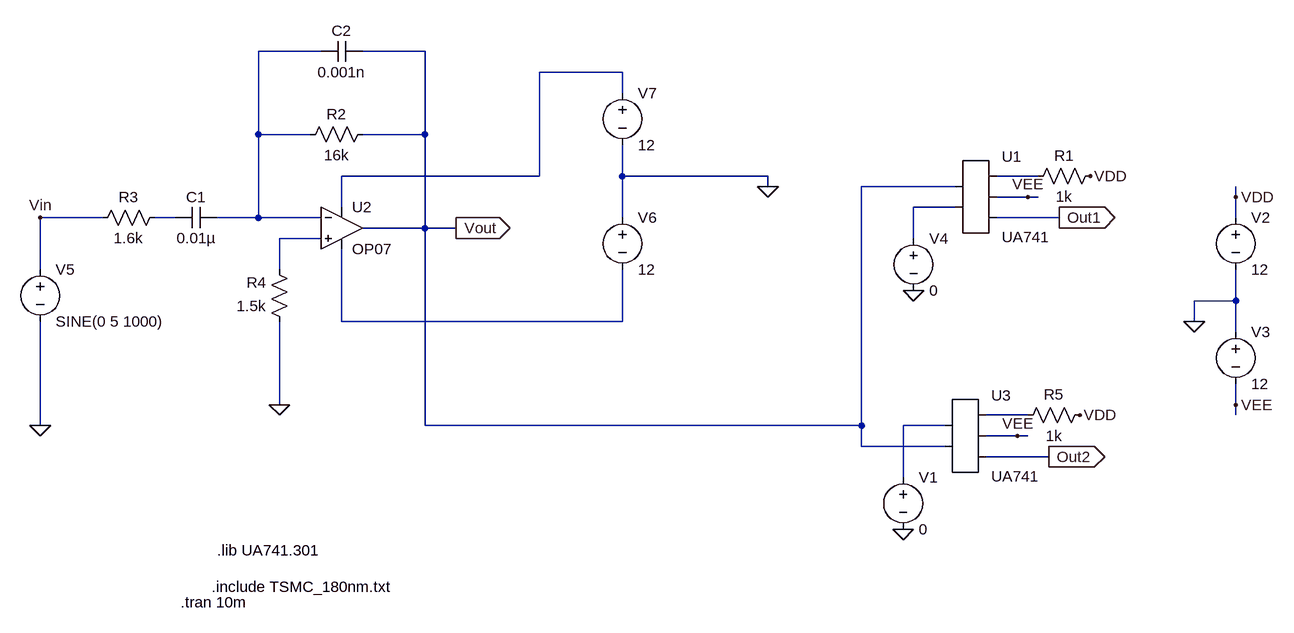
[diagram p0: schematic Lt_Spice simulation.asc]
Lt_Spice simulation.asc, the LTspice schematic file:
Version 4
SHEET 1 1080 680
WIRE -384 -256 -480 -256
WIRE -224 -256 -320 -256
WIRE 80 -224 -48 -224
WIRE 80 -192 80 -224
WIRE -480 -128 -480 -256
WIRE -400 -128 -480 -128
WIRE -224 -128 -224 -256
WIRE -224 -128 -320 -128
WIRE -48 -64 -48 -224
WIRE -48 -64 -352 -64
WIRE 80 -64 80 -112
WIRE 304 -64 80 -64
WIRE 720 -64 656 -64
WIRE 304 -48 304 -64
WIRE 592 -48 448 -48
WIRE 704 -32 656 -32
WIRE 720 -32 704 -32
WIRE 1024 -32 1024 -48
WIRE -352 -16 -352 -64
WIRE 592 -16 528 -16
WIRE -720 0 -816 0
WIRE -608 0 -640 0
WIRE -480 0 -480 -128
WIRE -480 0 -544 0
WIRE -384 0 -480 0
WIRE 80 0 80 -64
WIRE 752 0 656 0
WIRE 1024 0 1024 -32
WIRE -224 16 -224 -128
WIRE -224 16 -320 16
WIRE -176 16 -224 16
WIRE -384 32 -448 32
WIRE 528 32 528 -16
WIRE -816 80 -816 0
WIRE -448 80 -448 32
WIRE 1024 128 1024 80
WIRE 1024 128 960 128
WIRE -352 160 -352 48
WIRE 80 160 80 80
WIRE 80 160 -352 160
WIRE 960 160 960 128
WIRE 1024 176 1024 128
WIRE -448 288 -448 160
WIRE 1024 288 1024 256
WIRE 704 304 640 304
WIRE 1024 304 1024 288
WIRE -816 320 -816 160
WIRE -224 320 -224 16
WIRE 448 320 448 -48
WIRE 448 320 -224 320
WIRE 576 320 512 320
WIRE 688 336 640 336
WIRE 704 336 688 336
WIRE 448 352 448 320
WIRE 576 352 448 352
WIRE 736 368 640 368
WIRE 512 400 512 320
FLAG 960 160 0
FLAG 752 0 Out1
IOPIN 752 0 Out
FLAG 704 -32 VEE
FLAG 1024 288 VEE
FLAG 528 112 0
FLAG 800 -64 VDD
FLAG 1024 -32 VDD
FLAG -816 320 0
FLAG -448 288 0
FLAG 304 -48 0
FLAG -816 0 Vin
FLAG -176 16 Vout
IOPIN -176 16 Out
FLAG 736 368 Out2
IOPIN 736 368 Out
FLAG 688 336 VEE
FLAG 512 480 0
FLAG 784 304 VDD
SYMBOL AutoGenerated\\UA741 624 -32 R0
SYMATTR InstName U1
SYMBOL voltage 1024 -16 R0
WINDOW 123 0 0 Left 0
WINDOW 39 0 0 Left 0
SYMATTR InstName V2
SYMATTR Value 12
SYMBOL voltage 1024 160 R0
WINDOW 123 0 0 Left 0
WINDOW 39 0 0 Left 0
SYMATTR InstName V3
SYMATTR Value 12
SYMBOL voltage 528 16 R0
WINDOW 123 0 0 Left 0
WINDOW 39 0 0 Left 0
SYMATTR InstName V4
SYMATTR Value 0
SYMBOL res 816 -80 R90
WINDOW 0 0 56 VBottom 2
WINDOW 3 32 56 VTop 2
SYMATTR InstName R1
SYMATTR Value 1k
SYMBOL res -304 -144 R90
WINDOW 0 0 56 VBottom 2
WINDOW 3 32 56 VTop 2
SYMATTR InstName R2
SYMATTR Value 16k
SYMBOL OpAmps\\OP07 -352 -48 R0
SYMATTR InstName U2
SYMBOL res -624 -16 R90
WINDOW 0 0 56 VBottom 2
WINDOW 3 32 56 VTop 2
SYMATTR InstName R3
SYMATTR Value 1.6k
SYMBOL res -432 176 R180
WINDOW 0 36 76 Left 2
WINDOW 3 36 40 Left 2
SYMATTR InstName R4
SYMATTR Value 1.5k
SYMBOL cap -544 -16 R90
WINDOW 0 0 32 VBottom 2
WINDOW 3 32 32 VTop 2
SYMATTR InstName C1
SYMATTR Value 0.01µ
SYMBOL voltage -816 64 R0
WINDOW 123 0 0 Left 0
WINDOW 39 0 0 Left 0
SYMATTR InstName V5
SYMATTR Value SINE(0 5 1000)
SYMBOL voltage 80 -16 R0
WINDOW 123 0 0 Left 0
WINDOW 39 0 0 Left 0
SYMATTR InstName V6
SYMATTR Value 12
SYMBOL voltage 80 -208 R0
WINDOW 123 0 0 Left 0
WINDOW 39 0 0 Left 0
SYMATTR InstName V7
SYMATTR Value 12
SYMBOL cap -320 -272 R90
WINDOW 0 0 32 VBottom 2
WINDOW 3 32 32 VTop 2
SYMATTR InstName C2
SYMATTR Value 0.001n
SYMBOL AutoGenerated\\UA741 608 336 R0
SYMATTR InstName U3
SYMBOL voltage 512 384 R0
WINDOW 123 0 0 Left 0
WINDOW 39 0 0 Left 0
SYMATTR InstName V1
SYMATTR Value 0
SYMBOL res 800 288 R90
WINDOW 0 0 56 VBottom 2
WINDOW 3 32 56 VTop 2
SYMATTR InstName R5
SYMATTR Value 1k
TEXT -544 512 Left 2 !.lib UA741.301
TEXT -552 568 Left 2 !.include TSMC_180nm.txt
TEXT -600 592 Left 2 !.tran 10m

The netlist it stands for:
* Lt_Spice simulation.asc
* U1: UA741 (symbol AutoGenerated\UA741 not available, pins judged from their places): pin1=Vout pin2=N004 pin3=N003 pin4=VEE pin5=Out1
V2 VDD 0 12
V3 0 VEE 12
V4 N004 0 0
R1 VDD N003 1k
R2 Vout N001 16k
XU2 N006 N001 N002 N007 Vout LT1001  ; OP07, pins In+ In- V+ V- OUT
R3 N005 Vin 1.6k
R4 0 N006 1.5k
C1 N001 N005 0.01µ
V5 Vin 0 SINE(0 5 1000)
V6 0 N007 12
V7 N002 0 12
C2 Vout N001 0.001n
* U3: UA741 (symbol AutoGenerated\UA741 not available, pins judged from their places): pin1=N009 pin2=Vout pin3=N008 pin4=VEE pin5=Out2
V1 N009 0 0
R5 VDD N008 1k
.lib UA741.301
.include TSMC_180nm.txt
.tran 10m
.lib LTC.lib
.backanno
.end